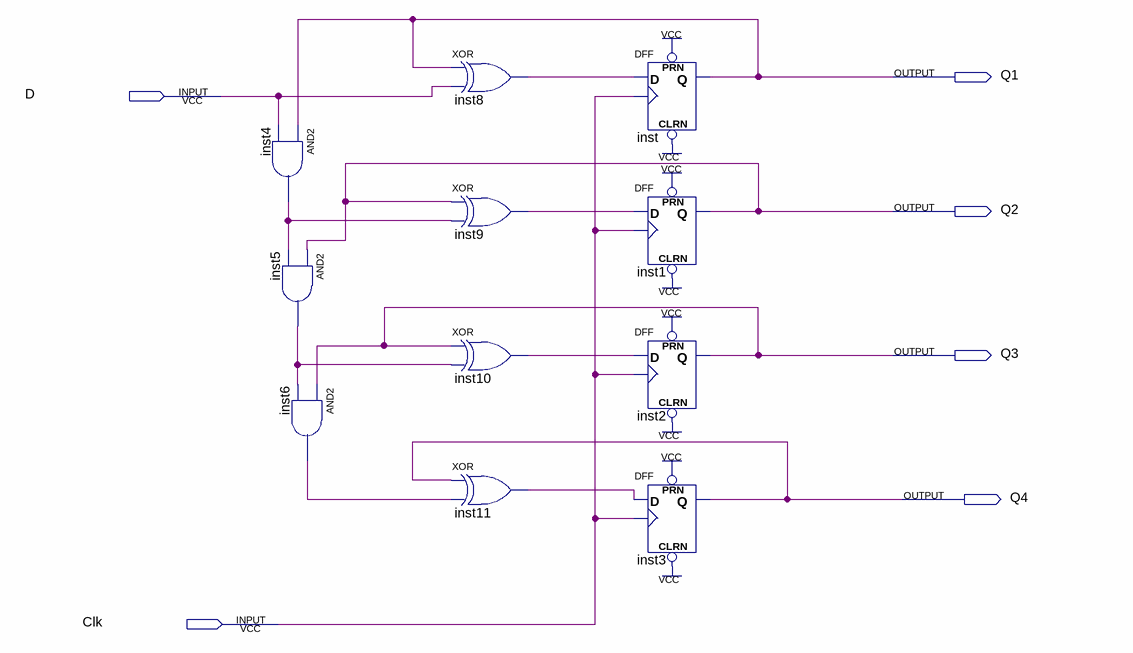
[diagram p0: schematic sheet]
// Quartus schematic lab10step2.bdf as structural Verilog: 11 symbols, 6 pins
module lab10step2 (
  input  D,
  input  Clk,
  output Q1,
  output Q2,
  output Q3,
  output Q4
);

  wire inst4_out, inst5_out, inst6_out, inst8_out, inst9_out, inst10_out, inst11_out;

  and inst4 (inst4_out, Q1, D);
  and inst5 (inst5_out, Q2, inst4_out);
  and inst6 (inst6_out, Q3, inst5_out);
  xor inst8 (inst8_out, Q1, D);
  xor inst9 (inst9_out, Q2, inst4_out);
  xor inst10 (inst10_out, Q3, inst5_out);
  xor inst11 (inst11_out, Q4, inst6_out);
  DFF inst (.CLRN(1'b1), .CLK(Clk), .D(inst8_out), .PRN(1'b1), .Q(Q1));
  DFF inst1 (.CLRN(1'b1), .CLK(Clk), .D(inst9_out), .PRN(1'b1), .Q(Q2));
  DFF inst2 (.CLRN(1'b1), .CLK(Clk), .D(inst10_out), .PRN(1'b1), .Q(Q3));
  DFF inst3 (.CLRN(1'b1), .CLK(Clk), .D(inst11_out), .PRN(1'b1), .Q(Q4));
endmodule
